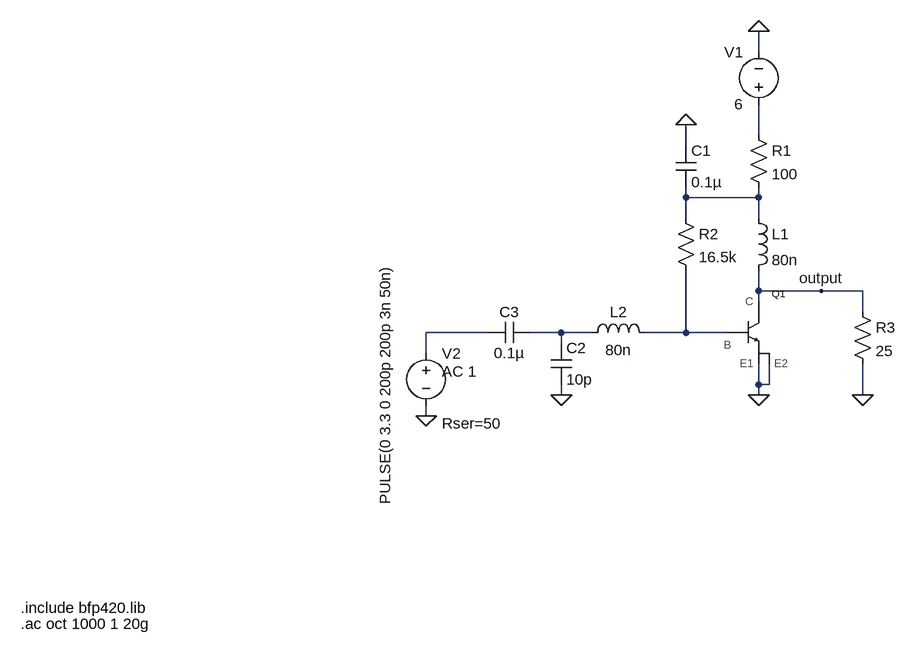
[diagram p0: schematic bfp420_amp.asc]
bfp420_amp.asc, the LTspice schematic file:
Version 4
SHEET 1 880 784
WIRE 240 -112 240 -144
WIRE 240 16 240 -32
WIRE 128 32 128 0
WIRE 128 112 128 96
WIRE 240 112 240 96
WIRE 240 112 128 112
WIRE 128 144 128 112
WIRE 240 144 240 112
WIRE 240 256 240 224
WIRE 336 256 240 256
WIRE 400 256 336 256
WIRE 240 272 240 256
WIRE 400 288 400 256
WIRE -176 320 -272 320
WIRE -64 320 -112 320
WIRE -16 320 -64 320
WIRE 128 320 128 224
WIRE 128 320 64 320
WIRE 192 320 128 320
WIRE -64 336 -64 320
WIRE -272 352 -272 320
WIRE 240 400 240 368
WIRE 256 400 256 368
WIRE 256 400 240 400
WIRE -64 416 -64 400
WIRE 240 416 240 400
WIRE 400 416 400 368
WIRE -272 448 -272 432
FLAG 240 -144 0
FLAG 128 0 0
FLAG -64 416 0
FLAG -272 448 0
FLAG 240 416 0
FLAG 400 416 0
FLAG 336 256 output
SYMBOL res 224 0 R0
SYMATTR InstName R1
SYMATTR Value 100
SYMBOL res 112 128 R0
SYMATTR InstName R2
SYMATTR Value 16.5k
SYMBOL ind 224 128 R0
SYMATTR InstName L1
SYMATTR Value 80n
SYMBOL voltage 240 -16 R180
WINDOW 0 24 96 Left 2
WINDOW 3 24 16 Left 2
WINDOW 123 0 0 Left 2
WINDOW 39 0 0 Left 2
SYMATTR InstName V1
SYMATTR Value 6
SYMBOL ind -32 336 R270
WINDOW 0 32 56 VTop 2
WINDOW 3 5 56 VBottom 2
SYMATTR InstName L2
SYMATTR Value 80n
SYMBOL cap 112 32 R0
SYMATTR InstName C1
SYMATTR Value 0.1µ
SYMBOL cap -80 336 R0
SYMATTR InstName C2
SYMATTR Value 10p
SYMBOL cap -112 304 R90
WINDOW 0 0 32 VBottom 2
WINDOW 3 32 32 VTop 2
SYMATTR InstName C3
SYMATTR Value 0.1µ
SYMBOL voltage -272 336 R0
WINDOW 3 -63 -122 VRight 2
WINDOW 123 24 44 Left 2
WINDOW 39 24 124 Left 2
SYMATTR Value PULSE(0 3.3 0 200p 200p 3n 50n)
SYMATTR Value2 AC 1
SYMATTR SpiceLine Rser=50
SYMATTR InstName V2
SYMBOL bfp420 240 320 R0
SYMATTR InstName Q1
SYMATTR Prefix X
SYMATTR Value BFP420
SYMBOL res 384 272 R0
SYMATTR InstName R3
SYMATTR Value 25
TEXT -896 744 Left 2 !.include bfp420.lib
TEXT -896 768 Left 2 !.ac oct 1000 1 20g

The netlist it stands for:
* bfp420_amp.asc
R1 N001 N002 100
R2 N002 N005 16.5k
L1 N002 output 80n
V1 N001 0 6
L2 N004 N005 80n
C1 0 N002 0.1µ
C2 N004 0 10p
C3 N004 N003 0.1µ
V2 N003 0 PULSE(0 3.3 0 200p 200p 3n 50n) AC 1 Rser=50
XQ1 output N005 0 0 bfp420 params: BFP420  ; pins C B E1 E2
R3 output 0 25
.include bfp420.lib
.ac oct 1000 1 20g
.backanno
.end